# Altium project AMC_FMC_Carrier v2.PrjPcb (part 3 of 9)

## Sheet FMC_HPC1.SchDoc
size A3; DocumentNumber: 19; SheetNumber: 19; SheetTotal: 30
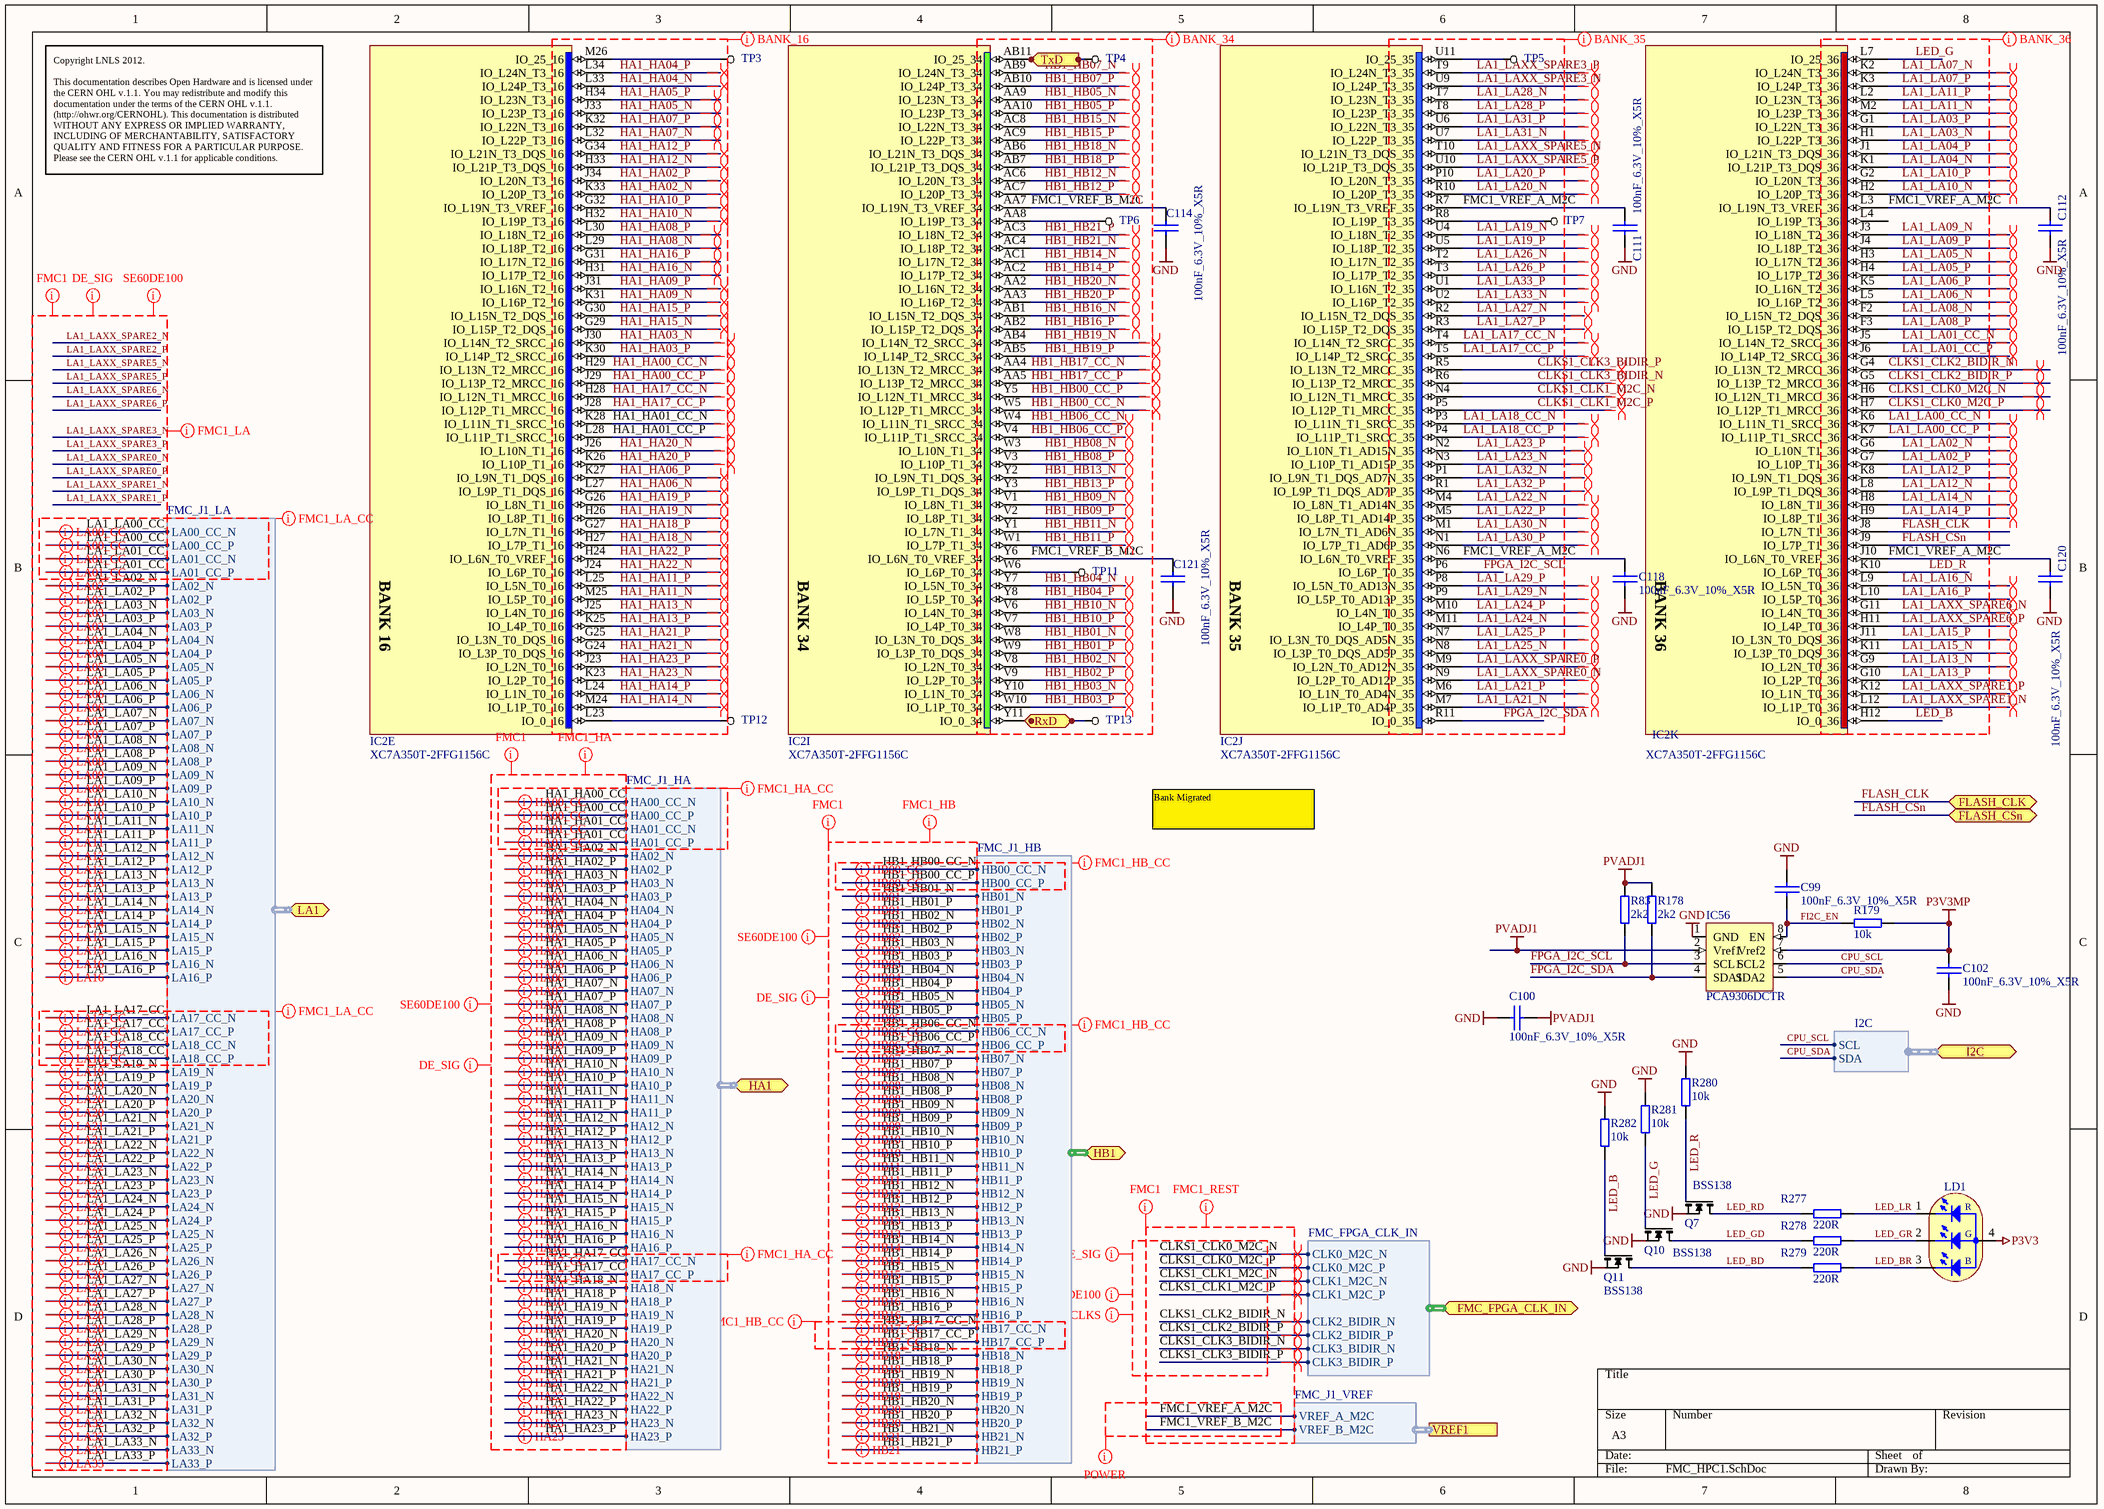
[diagram p5: FMC_HPC1.SchDoc]

### Parts
C99  100nF_6.3V_10%_X5R  [0201C]
C100  100nF_6.3V_10%_X5R  [0201C]
C102  100nF_6.3V_10%_X5R  [0201C]
C111  100nF_6.3V_10%_X5R  [0201C]
C112  100nF_6.3V_10%_X5R  [0201C]
C114  100nF_6.3V_10%_X5R  [0201C]
C118  100nF_6.3V_10%_X5R  [0201C]
C120  100nF_6.3V_10%_X5R  [0201C]
C121  100nF_6.3V_10%_X5R  [0201C]
IC2  XC7A350T-2FFG1156C  [BGA1156C100P34X34_3500X3500X335]  (parts E,I,J,K of 23)
IC56  PCA9306DCTR  [SSOP8]
LD1  Red/Green/Blue  [LED_OPTEK_OVSRRGBCC3_a]  (value not drawn)
Q7  BSS138  [SOT-23]
Q10  BSS138  [SOT-23]
Q11  BSS138  [SOT-23]
R83  2k2  [0402R]
R178  2k2  [0402R]
R179  10k  [0402R]
R277  220R  [0402R]
R278  220R  [0402R]
R279  220R  [0402R]
R280  10k  [0402R]
R281  10k  [0402R]
R282  10k  [0402R]
TP3  TP  [TP_large]  (value not drawn)
TP4  TP  [TP_large]  (value not drawn)
TP5  TP  [TP_large]  (value not drawn)
TP6  TP  [TP_large]  (value not drawn)
TP7  TP  [TP_large]  (value not drawn)
TP11  TP  [TP_large]  (value not drawn)
TP12  TP  [TP_large]  (value not drawn)
TP13  TP  [TP_large]  (value not drawn)

### Ports
FLASH_CLK, FLASH_CSn, FMC_FPGA_CLK_IN (harness FMC_FPGA_CLK_IN), HA1 (harness FMC_J1_HA), HB1 (harness FMC_J1_HB), I2C (harness I2C), LA1 (harness FMC_J1_LA), RxD (out), TxD (in), VREF1 (harness FMC_J1_VREF)

### Harnesses
FMC_J1_LA: LA05_N, LA05_P, LA06_N, LA06_P, LA09_N, LA09_P, LA10_N, LA10_P, LA13_N, LA13_P, LA14_N, LA14_P, LA23_N, LA23_P, LA26_N, LA26_P, LA27_N, LA27_P, LA02_N, LA02_P, LA03_N, LA03_P, LA04_N, LA04_P, LA07_N, LA07_P, LA08_N, LA08_P, LA11_N, LA11_P, LA12_N, LA12_P, LA15_N, LA15_P, LA16_N, LA16_P, LA19_N, LA19_P, LA20_N, LA20_P, LA21_N, LA21_P, LA22_N, LA22_P, LA24_N, LA24_P, LA25_N, LA25_P, LA28_N, LA28_P, LA29_N, LA29_P, LA30_N, LA30_P, LA31_N, LA31_P, LA32_N, LA32_P, LA33_N, LA33_P, LA00_CC_N, LA00_CC_P, LA01_CC_N, LA01_CC_P, LA17_CC_N, LA17_CC_P, LA18_CC_N, LA18_CC_P
FMC_J1_VREF: VREF_A_M2C, VREF_B_M2C
FMC_FPGA_CLK_IN: CLK0_M2C_N, CLK0_M2C_P, CLK1_M2C_N, CLK1_M2C_P, CLK2_BIDIR_N, CLK2_BIDIR_P, CLK3_BIDIR_N, CLK3_BIDIR_P
FMC_J1_HB: HB02_N, HB02_P, HB03_N, HB03_P, HB04_N, HB04_P, HB05_N, HB05_P, HB08_N, HB08_P, HB09_N, HB09_P, HB12_N, HB12_P, HB13_N, HB13_P, HB16_N, HB16_P, HB19_N, HB19_P, HB20_N, HB20_P, HB21_N, HB21_P, HB01_N, HB01_P, HB07_N, HB07_P, HB10_N, HB10_P, HB11_N, HB11_P, HB14_N, HB14_P, HB15_N, HB15_P, HB18_N, HB18_P, HB17_CC_N, HB17_CC_P, HB06_CC_N, HB06_CC_P, HB00_CC_N, HB00_CC_P
FMC_J1_HA: HA04_N, HA04_P, HA05_N, HA05_P, HA08_N, HA08_P, HA09_N, HA09_P, HA12_N, HA12_P, HA13_N, HA13_P, HA15_N, HA15_P, HA16_N, HA16_P, HA19_N, HA19_P, HA20_N, HA20_P, HA02_N, HA02_P, HA03_N, HA03_P, HA06_N, HA06_P, HA07_N, HA07_P, HA10_N, HA10_P, HA11_N, HA11_P, HA14_N, HA14_P, HA18_N, HA18_P, HA21_N, HA21_P, HA22_N, HA22_P, HA23_N, HA23_P, HA17_CC_N, HA17_CC_P, HA00_CC_N, HA00_CC_P, HA01_CC_N, HA01_CC_P
I2C: SCL, SDA

### Nets
GND: C99.2 C100.2 C102.2 C111.2 C112.2 C114.2 C118.2 C120.2 C121.2 IC56.1(GND) Q7.2(S) Q10.2(S) Q11.2(S) R280.1 R281.1 R282.1
P3V3: LD1.4(CC)
P3V3MP: C102.1 IC56.7(Vref2) R179.2
PVADJ1: C100.1 IC56.2(Vref1) R83.2 R178.2
CLKS1_CLK0_M2C_N: IC2.H6(IO_L12N_T1_MRCC_36) ; port FMC_FPGA_CLK_IN.CLK0_M2C_N  [project net FMCC1.CLK0_M2C_N]
CLKS1_CLK0_M2C_P: IC2.H7(IO_L12P_T1_MRCC_36) ; port FMC_FPGA_CLK_IN.CLK0_M2C_P  [project net FMCC1.CLK0_M2C_P]
CLKS1_CLK1_M2C_N: IC2.N4(IO_L12N_T1_MRCC_35) ; port FMC_FPGA_CLK_IN.CLK1_M2C_N  [project net FMCC1.CLK1_M2C_N]
CLKS1_CLK1_M2C_P: IC2.P5(IO_L12P_T1_MRCC_35) ; port FMC_FPGA_CLK_IN.CLK1_M2C_P  [project net FMCC1.CLK1_M2C_P]
CLKS1_CLK2_BIDIR_N: IC2.G4(IO_L13N_T2_MRCC_36) ; port FMC_FPGA_CLK_IN.CLK2_BIDIR_N  [project net FMCC1.CLK2_BIDIR_N]
CLKS1_CLK2_BIDIR_P: IC2.G5(IO_L13P_T2_MRCC_36) ; port FMC_FPGA_CLK_IN.CLK2_BIDIR_P  [project net FMCC1.CLK2_BIDIR_P]
CLKS1_CLK3_BIDIR_N: IC2.R6(IO_L13P_T2_MRCC_35) ; port FMC_FPGA_CLK_IN.CLK3_BIDIR_N  [project net FMCC1.CLK3_BIDIR_N]
CLKS1_CLK3_BIDIR_P: IC2.R5(IO_L13N_T2_MRCC_35) ; port FMC_FPGA_CLK_IN.CLK3_BIDIR_P  [project net FMCC1.CLK3_BIDIR_P]
CPU_SCL: IC56.6(SCL2) ; port I2C.SCL  [project net CPU.SCL]
CPU_SDA: IC56.5(SDA2) ; port I2C.SDA  [project net CPU.SDA]
FI2C_EN: C99.1 IC56.8(EN) R179.1
FLASH_CLK: IC2.J8(IO_L7N_T1_36) ; port FLASH_CLK
FLASH_CSn: IC2.J9(IO_L7P_T1_36) ; port FLASH_CSn
FMC1_VREF_A_M2C: C111.1 C112.1 C118.1 C120.1 IC2.J10(IO_L6N_T0_VREF_36) IC2.L3(IO_L19N_T3_VREF_36) IC2.N6(IO_L6N_T0_VREF_35) IC2.R7(IO_L19N_T3_VREF_35) ; port VREF1.VREF_A_M2C  [project net VREF1.VREF_A_M2C]
FMC1_VREF_B_M2C: C114.1 C121.1 IC2.AA7(IO_L19N_T3_VREF_34) IC2.Y6(IO_L6N_T0_VREF_34) ; port VREF1.VREF_B_M2C  [project net VREF1.VREF_B_M2C]
FPGA_I2C_SCL: IC2.P6(IO_L6P_T0_35) IC56.3(SCL1) R83.1
FPGA_I2C_SDA: IC2.R11(IO_0_35) IC56.4(SDA1) R178.1
HA1_HA00_CC_N: IC2.H29(IO_L13N_T2_MRCC_16) ; port HA1.HA00_CC_N  [project net HA1.HA00_CC_N]
HA1_HA00_CC_P: IC2.J29(IO_L13P_T2_MRCC_16) ; port HA1.HA00_CC_P  [project net HA1.HA00_CC_P]
HA1_HA01_CC_N: IC2.K28(IO_L11N_T1_SRCC_16) ; port HA1.HA01_CC_N  [project net HA1.HA01_CC_N]
HA1_HA01_CC_P: IC2.L28(IO_L11P_T1_SRCC_16) ; port HA1.HA01_CC_P  [project net HA1.HA01_CC_P]
HA1_HA02_N: IC2.K33(IO_L20P_T3_16) ; port HA1.HA02_N  [project net HA1.HA02_N]
HA1_HA02_P: IC2.J34(IO_L20N_T3_16) ; port HA1.HA02_P  [project net HA1.HA02_P]
HA1_HA03_N: IC2.J30(IO_L14N_T2_SRCC_16) ; port HA1.HA03_N  [project net HA1.HA03_N]
HA1_HA03_P: IC2.K30(IO_L14P_T2_SRCC_16) ; port HA1.HA03_P  [project net HA1.HA03_P]
HA1_HA04_N: IC2.L33(IO_L24P_T3_16) ; port HA1.HA04_N  [project net HA1.HA04_N]
HA1_HA04_P: IC2.L34(IO_L24N_T3_16) ; port HA1.HA04_P  [project net HA1.HA04_P]
HA1_HA05_N: IC2.J33(IO_L23P_T3_16) ; port HA1.HA05_N  [project net HA1.HA05_N]
HA1_HA05_P: IC2.H34(IO_L23N_T3_16) ; port HA1.HA05_P  [project net HA1.HA05_P]
HA1_HA06_N: IC2.L27(IO_L9P_T1_DQS_16) ; port HA1.HA06_N  [project net HA1.HA06_N]
HA1_HA06_P: IC2.K27(IO_L9N_T1_DQS_16) ; port HA1.HA06_P  [project net HA1.HA06_P]
HA1_HA07_N: IC2.L32(IO_L22P_T3_16) ; port HA1.HA07_N  [project net HA1.HA07_N]
HA1_HA07_P: IC2.K32(IO_L22N_T3_16) ; port HA1.HA07_P  [project net HA1.HA07_P]
HA1_HA08_N: IC2.L29(IO_L18P_T2_16) ; port HA1.HA08_N  [project net HA1.HA08_N]
HA1_HA08_P: IC2.L30(IO_L18N_T2_16) ; port HA1.HA08_P  [project net HA1.HA08_P]
HA1_HA09_N: IC2.K31(IO_L16P_T2_16) ; port HA1.HA09_N  [project net HA1.HA09_N]
HA1_HA09_P: IC2.J31(IO_L16N_T2_16) ; port HA1.HA09_P  [project net HA1.HA09_P]
HA1_HA10_N: IC2.H32(IO_L19P_T3_16) ; port HA1.HA10_N  [project net HA1.HA10_N]
HA1_HA10_P: IC2.G32(IO_L19N_T3_VREF_16) ; port HA1.HA10_P  [project net HA1.HA10_P]
HA1_HA11_N: IC2.M25(IO_L5P_T0_16) ; port HA1.HA11_N  [project net HA1.HA11_N]
HA1_HA11_P: IC2.L25(IO_L5N_T0_16) ; port HA1.HA11_P  [project net HA1.HA11_P]
HA1_HA12_N: IC2.H33(IO_L21P_T3_DQS_16) ; port HA1.HA12_N  [project net HA1.HA12_N]
HA1_HA12_P: IC2.G34(IO_L21N_T3_DQS_16) ; port HA1.HA12_P  [project net HA1.HA12_P]
HA1_HA13_N: IC2.J25(IO_L4N_T0_16) ; port HA1.HA13_N  [project net HA1.HA13_N]
HA1_HA13_P: IC2.K25(IO_L4P_T0_16) ; port HA1.HA13_P  [project net HA1.HA13_P]
HA1_HA14_N: IC2.M24(IO_L1P_T0_16) ; port HA1.HA14_N  [project net HA1.HA14_N]
HA1_HA14_P: IC2.L24(IO_L1N_T0_16) ; port HA1.HA14_P  [project net HA1.HA14_P]
HA1_HA15_N: IC2.G29(IO_L15P_T2_DQS_16) ; port HA1.HA15_N  [project net HA1.HA15_N]
HA1_HA15_P: IC2.G30(IO_L15N_T2_DQS_16) ; port HA1.HA15_P  [project net HA1.HA15_P]
HA1_HA16_N: IC2.H31(IO_L17P_T2_16) ; port HA1.HA16_N  [project net HA1.HA16_N]
HA1_HA16_P: IC2.G31(IO_L17N_T2_16) ; port HA1.HA16_P  [project net HA1.HA16_P]
HA1_HA17_CC_N: IC2.H28(IO_L12N_T1_MRCC_16) ; port HA1.HA17_CC_N  [project net HA1.HA17_CC_N]
HA1_HA17_CC_P: IC2.J28(IO_L12P_T1_MRCC_16) ; port HA1.HA17_CC_P  [project net HA1.HA17_CC_P]
HA1_HA18_N: IC2.H27(IO_L7P_T1_16) ; port HA1.HA18_N  [project net HA1.HA18_N]
HA1_HA18_P: IC2.G27(IO_L7N_T1_16) ; port HA1.HA18_P  [project net HA1.HA18_P]
HA1_HA19_N: IC2.H26(IO_L8P_T1_16) ; port HA1.HA19_N  [project net HA1.HA19_N]
HA1_HA19_P: IC2.G26(IO_L8N_T1_16) ; port HA1.HA19_P  [project net HA1.HA19_P]
HA1_HA20_N: IC2.J26(IO_L10N_T1_16) ; port HA1.HA20_N  [project net HA1.HA20_N]
HA1_HA20_P: IC2.K26(IO_L10P_T1_16) ; port HA1.HA20_P  [project net HA1.HA20_P]
HA1_HA21_N: IC2.G24(IO_L3P_T0_DQS_16) ; port HA1.HA21_N  [project net HA1.HA21_N]
HA1_HA21_P: IC2.G25(IO_L3N_T0_DQS_16) ; port HA1.HA21_P  [project net HA1.HA21_P]
HA1_HA22_N: IC2.J24(IO_L6P_T0_16) ; port HA1.HA22_N  [project net HA1.HA22_N]
HA1_HA22_P: IC2.H24(IO_L6N_T0_VREF_16) ; port HA1.HA22_P  [project net HA1.HA22_P]
HA1_HA23_N: IC2.K23(IO_L2P_T0_16) ; port HA1.HA23_N  [project net HA1.HA23_N]
HA1_HA23_P: IC2.J23(IO_L2N_T0_16) ; port HA1.HA23_P  [project net HA1.HA23_P]
HB1_HB00_CC_N: IC2.W5(IO_L12P_T1_MRCC_34) ; port HB1.HB00_CC_N  [project net HB1.HB00_CC_N]
HB1_HB00_CC_P: IC2.Y5(IO_L12N_T1_MRCC_34) ; port HB1.HB00_CC_P  [project net HB1.HB00_CC_P]
HB1_HB01_N: IC2.W8(IO_L3N_T0_DQS_34) ; port HB1.HB01_N  [project net HB1.HB01_N]
HB1_HB01_P: IC2.W9(IO_L3P_T0_DQS_34) ; port HB1.HB01_P  [project net HB1.HB01_P]
HB1_HB02_N: IC2.V8(IO_L2N_T0_34) ; port HB1.HB02_N  [project net HB1.HB02_N]
HB1_HB02_P: IC2.V9(IO_L2P_T0_34) ; port HB1.HB02_P  [project net HB1.HB02_P]
HB1_HB03_N: IC2.Y10(IO_L1N_T0_34) ; port HB1.HB03_N  [project net HB1.HB03_N]
HB1_HB03_P: IC2.W10(IO_L1P_T0_34) ; port HB1.HB03_P  [project net HB1.HB03_P]
HB1_HB04_N: IC2.Y7(IO_L5N_T0_34) ; port HB1.HB04_N  [project net HB1.HB04_N]
HB1_HB04_P: IC2.Y8(IO_L5P_T0_34) ; port HB1.HB04_P  [project net HB1.HB04_P]
HB1_HB05_N: IC2.AA9(IO_L23N_T3_34) ; port HB1.HB05_N  [project net HB1.HB05_N]
HB1_HB05_P: IC2.AA10(IO_L23P_T3_34) ; port HB1.HB05_P  [project net HB1.HB05_P]
HB1_HB06_CC_N: IC2.W4(IO_L11N_T1_SRCC_34) ; port HB1.HB06_CC_N  [project net HB1.HB06_CC_N]
HB1_HB06_CC_P: IC2.V4(IO_L11P_T1_SRCC_34) ; port HB1.HB06_CC_P  [project net HB1.HB06_CC_P]
HB1_HB07_N: IC2.AB9(IO_L24N_T3_34) ; port HB1.HB07_N  [project net HB1.HB07_N]
HB1_HB07_P: IC2.AB10(IO_L24P_T3_34) ; port HB1.HB07_P  [project net HB1.HB07_P]
HB1_HB08_N: IC2.W3(IO_L10N_T1_34) ; port HB1.HB08_N  [project net HB1.HB08_N]
HB1_HB08_P: IC2.V3(IO_L10P_T1_34) ; port HB1.HB08_P  [project net HB1.HB08_P]
HB1_HB09_N: IC2.V1(IO_L8N_T1_34) ; port HB1.HB09_N  [project net HB1.HB09_N]
HB1_HB09_P: IC2.V2(IO_L8P_T1_34) ; port HB1.HB09_P  [project net HB1.HB09_P]
HB1_HB10_N: IC2.V6(IO_L4N_T0_34) ; port HB1.HB10_N  [project net HB1.HB10_N]
HB1_HB10_P: IC2.V7(IO_L4P_T0_34) ; port HB1.HB10_P  [project net HB1.HB10_P]
HB1_HB11_N: IC2.Y1(IO_L7N_T1_34) ; port HB1.HB11_N  [project net HB1.HB11_N]
HB1_HB11_P: IC2.W1(IO_L7P_T1_34) ; port HB1.HB11_P  [project net HB1.HB11_P]
HB1_HB12_N: IC2.AC6(IO_L20N_T3_34) ; port HB1.HB12_N  [project net HB1.HB12_N]
HB1_HB12_P: IC2.AC7(IO_L20P_T3_34) ; port HB1.HB12_P  [project net HB1.HB12_P]
HB1_HB13_N: IC2.Y2(IO_L9N_T1_DQS_34) ; port HB1.HB13_N  [project net HB1.HB13_N]
HB1_HB13_P: IC2.Y3(IO_L9P_T1_DQS_34) ; port HB1.HB13_P  [project net HB1.HB13_P]
HB1_HB14_N: IC2.AC1(IO_L17N_T2_34) ; port HB1.HB14_N  [project net HB1.HB14_N]
HB1_HB14_P: IC2.AC2(IO_L17P_T2_34) ; port HB1.HB14_P  [project net HB1.HB14_P]
HB1_HB15_N: IC2.AC8(IO_L22N_T3_34) ; port HB1.HB15_N  [project net HB1.HB15_N]
HB1_HB15_P: IC2.AC9(IO_L22P_T3_34) ; port HB1.HB15_P  [project net HB1.HB15_P]
HB1_HB16_N: IC2.AB1(IO_L15N_T2_DQS_34) ; port HB1.HB16_N  [project net HB1.HB16_N]
HB1_HB16_P: IC2.AB2(IO_L15P_T2_DQS_34) ; port HB1.HB16_P  [project net HB1.HB16_P]
HB1_HB17_CC_N: IC2.AA4(IO_L13N_T2_MRCC_34) ; port HB1.HB17_CC_N  [project net HB1.HB17_CC_N]
HB1_HB17_CC_P: IC2.AA5(IO_L13P_T2_MRCC_34) ; port HB1.HB17_CC_P  [project net HB1.HB17_CC_P]
HB1_HB18_N: IC2.AB6(IO_L21N_T3_DQS_34) ; port HB1.HB18_N  [project net HB1.HB18_N]
HB1_HB18_P: IC2.AB7(IO_L21P_T3_DQS_34) ; port HB1.HB18_P  [project net HB1.HB18_P]
HB1_HB19_N: IC2.AB4(IO_L14N_T2_SRCC_34) ; port HB1.HB19_N  [project net HB1.HB19_N]
HB1_HB19_P: IC2.AB5(IO_L14P_T2_SRCC_34) ; port HB1.HB19_P  [project net HB1.HB19_P]
HB1_HB20_N: IC2.AA2(IO_L16N_T2_34) ; port HB1.HB20_N  [project net HB1.HB20_N]
HB1_HB20_P: IC2.AA3(IO_L16P_T2_34) ; port HB1.HB20_P  [project net HB1.HB20_P]
HB1_HB21_N: IC2.AC4(IO_L18P_T2_34) ; port HB1.HB21_N  [project net HB1.HB21_N]
HB1_HB21_P: IC2.AC3(IO_L18N_T2_34) ; port HB1.HB21_P  [project net HB1.HB21_P]
LA1_LA00_CC_N: IC2.K6(IO_L11N_T1_SRCC_36) ; port LA1.LA00_CC_N  [project net LA1.LA00_CC_N]
LA1_LA00_CC_P: IC2.K7(IO_L11P_T1_SRCC_36) ; port LA1.LA00_CC_P  [project net LA1.LA00_CC_P]
LA1_LA01_CC_N: IC2.J5(IO_L14N_T2_SRCC_36) ; port LA1.LA01_CC_N  [project net LA1.LA01_CC_N]
LA1_LA01_CC_P: IC2.J6(IO_L14P_T2_SRCC_36) ; port LA1.LA01_CC_P  [project net LA1.LA01_CC_P]
LA1_LA02_N: IC2.G6(IO_L10N_T1_36) ; port LA1.LA02_N  [project net LA1.LA02_N]
LA1_LA02_P: IC2.G7(IO_L10P_T1_36) ; port LA1.LA02_P  [project net LA1.LA02_P]
LA1_LA03_N: IC2.H1(IO_L22P_T3_36) ; port LA1.LA03_N  [project net LA1.LA03_N]
LA1_LA03_P: IC2.G1(IO_L22N_T3_36) ; port LA1.LA03_P  [project net LA1.LA03_P]
LA1_LA04_N: IC2.K1(IO_L21P_T3_DQS_36) ; port LA1.LA04_N  [project net LA1.LA04_N]
LA1_LA04_P: IC2.J1(IO_L21N_T3_DQS_36) ; port LA1.LA04_P  [project net LA1.LA04_P]
LA1_LA05_N: IC2.H3(IO_L17N_T2_36) ; port LA1.LA05_N  [project net LA1.LA05_N]
LA1_LA05_P: IC2.H4(IO_L17P_T2_36) ; port LA1.LA05_P  [project net LA1.LA05_P]
LA1_LA06_N: IC2.L5(IO_L16P_T2_36) ; port LA1.LA06_N  [project net LA1.LA06_N]
LA1_LA06_P: IC2.K5(IO_L16N_T2_36) ; port LA1.LA06_P  [project net LA1.LA06_P]
LA1_LA07_N: IC2.K2(IO_L24N_T3_36) ; port LA1.LA07_N  [project net LA1.LA07_N]
LA1_LA07_P: IC2.K3(IO_L24P_T3_36) ; port LA1.LA07_P  [project net LA1.LA07_P]
LA1_LA08_N: IC2.F2(IO_L15N_T2_DQS_36) ; port LA1.LA08_N  [project net LA1.LA08_N]
LA1_LA08_P: IC2.F3(IO_L15P_T2_DQS_36) ; port LA1.LA08_P  [project net LA1.LA08_P]
LA1_LA09_N: IC2.J3(IO_L18N_T2_36) ; port LA1.LA09_N  [project net LA1.LA09_N]
LA1_LA09_P: IC2.J4(IO_L18P_T2_36) ; port LA1.LA09_P  [project net LA1.LA09_P]
LA1_LA10_N: IC2.H2(IO_L20P_T3_36) ; port LA1.LA10_N  [project net LA1.LA10_N]
LA1_LA10_P: IC2.G2(IO_L20N_T3_36) ; port LA1.LA10_P  [project net LA1.LA10_P]
LA1_LA11_N: IC2.M2(IO_L23P_T3_36) ; port LA1.LA11_N  [project net LA1.LA11_N]
LA1_LA11_P: IC2.L2(IO_L23N_T3_36) ; port LA1.LA11_P  [project net LA1.LA11_P]
LA1_LA12_N: IC2.L8(IO_L9P_T1_DQS_36) ; port LA1.LA12_N  [project net LA1.LA12_N]
LA1_LA12_P: IC2.K8(IO_L9N_T1_DQS_36) ; port LA1.LA12_P  [project net LA1.LA12_P]
LA1_LA13_N: IC2.G9(IO_L2N_T0_36) ; port LA1.LA13_N  [project net LA1.LA13_N]
LA1_LA13_P: IC2.G10(IO_L2P_T0_36) ; port LA1.LA13_P  [project net LA1.LA13_P]
LA1_LA14_N: IC2.H8(IO_L8N_T1_36) ; port LA1.LA14_N  [project net LA1.LA14_N]
LA1_LA14_P: IC2.H9(IO_L8P_T1_36) ; port LA1.LA14_P  [project net LA1.LA14_P]
LA1_LA15_N: IC2.K11(IO_L3P_T0_DQS_36) ; port LA1.LA15_N  [project net LA1.LA15_N]
LA1_LA15_P: IC2.J11(IO_L3N_T0_DQS_36) ; port LA1.LA15_P  [project net LA1.LA15_P]
LA1_LA16_N: IC2.L9(IO_L5N_T0_36) ; port LA1.LA16_N  [project net LA1.LA16_N]
LA1_LA16_P: IC2.L10(IO_L5P_T0_36) ; port LA1.LA16_P  [project net LA1.LA16_P]
LA1_LA17_CC_N: IC2.T4(IO_L14N_T2_SRCC_35) ; port LA1.LA17_CC_N  [project net LA1.LA17_CC_N]
LA1_LA17_CC_P: IC2.T5(IO_L14P_T2_SRCC_35) ; port LA1.LA17_CC_P  [project net LA1.LA17_CC_P]
LA1_LA18_CC_N: IC2.P3(IO_L11N_T1_SRCC_35) ; port LA1.LA18_CC_N  [project net LA1.LA18_CC_N]
LA1_LA18_CC_P: IC2.P4(IO_L11P_T1_SRCC_35) ; port LA1.LA18_CC_P  [project net LA1.LA18_CC_P]
LA1_LA19_N: IC2.U4(IO_L18N_T2_35) ; port LA1.LA19_N  [project net LA1.LA19_N]
LA1_LA19_P: IC2.U5(IO_L18P_T2_35) ; port LA1.LA19_P  [project net LA1.LA19_P]
LA1_LA20_N: IC2.R10(IO_L20P_T3_35) ; port LA1.LA20_N  [project net LA1.LA20_N]
LA1_LA20_P: IC2.P10(IO_L20N_T3_35) ; port LA1.LA20_P  [project net LA1.LA20_P]
LA1_LA21_N: IC2.M7(IO_L1P_T0_AD4P_35) ; port LA1.LA21_N  [project net LA1.LA21_N]
LA1_LA21_P: IC2.M6(IO_L1N_T0_AD4N_35) ; port LA1.LA21_P  [project net LA1.LA21_P]
LA1_LA22_N: IC2.M4(IO_L8N_T1_AD14N_35) ; port LA1.LA22_N  [project net LA1.LA22_N]
LA1_LA22_P: IC2.M5(IO_L8P_T1_AD14P_35) ; port LA1.LA22_P  [project net LA1.LA22_P]
LA1_LA23_N: IC2.N3(IO_L10P_T1_AD15P_35) ; port LA1.LA23_N  [project net LA1.LA23_N]
LA1_LA23_P: IC2.N2(IO_L10N_T1_AD15N_35) ; port LA1.LA23_P  [project net LA1.LA23_P]
LA1_LA24_N: IC2.M11(IO_L4P_T0_35) ; port LA1.LA24_N  [project net LA1.LA24_N]
LA1_LA24_P: IC2.M10(IO_L4N_T0_35) ; port LA1.LA24_P  [project net LA1.LA24_P]
LA1_LA25_N: IC2.N8(IO_L3P_T0_DQS_AD5P_35) ; port LA1.LA25_N  [project net LA1.LA25_N]
LA1_LA25_P: IC2.N7(IO_L3N_T0_DQS_AD5N_35) ; port LA1.LA25_P  [project net LA1.LA25_P]
LA1_LA26_N: IC2.T2(IO_L17N_T2_35) ; port LA1.LA26_N  [project net LA1.LA26_N]
LA1_LA26_P: IC2.T3(IO_L17P_T2_35) ; port LA1.LA26_P  [project net LA1.LA26_P]
LA1_LA27_N: IC2.R2(IO_L15N_T2_DQS_35) ; port LA1.LA27_N  [project net LA1.LA27_N]
LA1_LA27_P: IC2.R3(IO_L15P_T2_DQS_35) ; port LA1.LA27_P  [project net LA1.LA27_P]
LA1_LA28_N: IC2.T7(IO_L23N_T3_35) ; port LA1.LA28_N  [project net LA1.LA28_N]
LA1_LA28_P: IC2.T8(IO_L23P_T3_35) ; port LA1.LA28_P  [project net LA1.LA28_P]
LA1_LA29_N: IC2.P9(IO_L5P_T0_AD13P_35) ; port LA1.LA29_N  [project net LA1.LA29_N]
LA1_LA29_P: IC2.P8(IO_L5N_T0_AD13N_35) ; port LA1.LA29_P  [project net LA1.LA29_P]
LA1_LA30_N: IC2.M1(IO_L7N_T1_AD6N_35) ; port LA1.LA30_N  [project net LA1.LA30_N]
LA1_LA30_P: IC2.N1(IO_L7P_T1_AD6P_35) ; port LA1.LA30_P  [project net LA1.LA30_P]
LA1_LA31_N: IC2.U7(IO_L22P_T3_35) ; port LA1.LA31_N  [project net LA1.LA31_N]
LA1_LA31_P: IC2.U6(IO_L22N_T3_35) ; port LA1.LA31_P  [project net LA1.LA31_P]
LA1_LA32_N: IC2.P1(IO_L9N_T1_DQS_AD7N_35) ; port LA1.LA32_N  [project net LA1.LA32_N]
LA1_LA32_P: IC2.R1(IO_L9P_T1_DQS_AD7P_35) ; port LA1.LA32_P  [project net LA1.LA32_P]
LA1_LA33_N: IC2.U2(IO_L16P_T2_35) ; port LA1.LA33_N  [project net LA1.LA33_N]
LA1_LA33_P: IC2.U1(IO_L16N_T2_35) ; port LA1.LA33_P  [project net LA1.LA33_P]
LA1_LAXX_SPARE0_N: IC2.N9(IO_L2P_T0_AD12P_35)
LA1_LAXX_SPARE0_P: IC2.M9(IO_L2N_T0_AD12N_35)
LA1_LAXX_SPARE1_N: IC2.L12(IO_L1P_T0_36)
LA1_LAXX_SPARE1_P: IC2.K12(IO_L1N_T0_36)
LA1_LAXX_SPARE3_N: IC2.U9(IO_L24P_T3_35)
LA1_LAXX_SPARE3_P: IC2.T9(IO_L24N_T3_35)
LA1_LAXX_SPARE5_N: IC2.T10(IO_L21N_T3_DQS_35)
LA1_LAXX_SPARE5_P: IC2.U10(IO_L21P_T3_DQS_35)
LA1_LAXX_SPARE6_N: IC2.G11(IO_L4N_T0_36)
LA1_LAXX_SPARE6_P: IC2.H11(IO_L4P_T0_36)
LED_B: IC2.H12(IO_0_36) Q11.1(G) R282.2
LED_BD: Q11.3(D) R279.1
LED_BR: LD1.3(AB) R279.2
LED_G: IC2.L7(IO_25_36) Q10.1(G) R281.2
LED_GD: Q10.3(D) R278.1
LED_GR: LD1.2(AG) R278.2
LED_LR: LD1.1(AR) R277.2
LED_R: IC2.K10(IO_L6P_T0_36) Q7.1(G) R280.2
LED_RD: Q7.3(D) R277.1
RxD_USB: IC2.Y11(IO_0_34) TP13.1 ; port RxD
TxD_USB: IC2.AB11(IO_25_34) TP4.1 ; port TxD
NetIC2_AA8: IC2.AA8(IO_L19P_T3_34) TP6.1
NetIC2_L23: IC2.L23(IO_0_16) TP12.1
NetIC2_M26: IC2.M26(IO_25_16) TP3.1
NetIC2_R8: IC2.R8(IO_L19P_T3_35) TP7.1
NetIC2_U11: IC2.U11(IO_25_35) TP5.1
NetIC2_W6: IC2.W6(IO_L6P_T0_34) TP11.1

Not connected (* = marked no-connect by the designer): IC2 L4(IO_L19P_T3_36)

### Layout directives
differential pair: FMCC1.CLK0_M2C_N, FMCC1.CLK0_M2C_P, FMCC1.CLK1_M2C_N, FMCC1.CLK1_M2C_P, FMCC1.CLK2_BIDIR_N, FMCC1.CLK2_BIDIR_P, FMCC1.CLK3_BIDIR_N, FMCC1.CLK3_BIDIR_P, HA1.HA00_CC_N, HA1.HA00_CC_P, HA1.HA01_CC_N, HA1.HA01_CC_P, HA1.HA02_N, HA1.HA02_P, HA1.HA03_N, HA1.HA03_P, HA1.HA04_N, HA1.HA04_P, HA1.HA05_N, HA1.HA05_P, HA1.HA06_N, HA1.HA06_P, HA1.HA07_N, HA1.HA07_P, HA1.HA08_N, HA1.HA08_P, HA1.HA09_N, HA1.HA09_P, HA1.HA10_N, HA1.HA10_P, HA1.HA11_N, HA1.HA11_P, HA1.HA12_N, HA1.HA12_P, HA1.HA13_N, HA1.HA13_P, HA1.HA14_N, HA1.HA14_P, HA1.HA15_N, HA1.HA15_P, HA1.HA16_N, HA1.HA16_P, HA1.HA17_CC_N, HA1.HA17_CC_P, HA1.HA18_N, HA1.HA18_P, HA1.HA19_N, HA1.HA19_P, HA1.HA20_N, HA1.HA20_P, HA1.HA21_N, HA1.HA21_P, HA1.HA22_N, HA1.HA22_P, HA1.HA23_N, HA1.HA23_P, HB1.HB00_CC_N, HB1.HB00_CC_P, HB1.HB01_N, HB1.HB01_P, HB1.HB02_N, HB1.HB02_P, HB1.HB03_N, HB1.HB03_P, HB1.HB04_N, HB1.HB04_P, HB1.HB05_N, HB1.HB05_P, HB1.HB06_CC_N, HB1.HB06_CC_P, HB1.HB07_N, HB1.HB07_P, HB1.HB08_N, HB1.HB08_P, HB1.HB09_N, HB1.HB09_P, HB1.HB10_N, HB1.HB10_P, HB1.HB11_N, HB1.HB11_P, HB1.HB12_N, HB1.HB12_P, HB1.HB13_N, HB1.HB13_P, HB1.HB14_N, HB1.HB14_P, HB1.HB15_N, HB1.HB15_P, HB1.HB16_N, HB1.HB16_P, HB1.HB17_CC_N, HB1.HB17_CC_P, HB1.HB18_N, HB1.HB18_P, HB1.HB19_N, HB1.HB19_P, HB1.HB20_N, HB1.HB20_P, HB1.HB21_N, HB1.HB21_P, LA1.LA00_CC_N, LA1.LA00_CC_P, LA1.LA01_CC_N, LA1.LA01_CC_P, LA1.LA02_N, LA1.LA02_P, LA1.LA03_N, LA1.LA03_P, LA1.LA04_N, LA1.LA04_P, LA1.LA05_N, LA1.LA05_P, LA1.LA06_N, LA1.LA06_P, LA1.LA07_N, LA1.LA07_P, LA1.LA08_N, LA1.LA08_P, LA1.LA09_N, LA1.LA09_P, LA1.LA10_N, LA1.LA10_P, LA1.LA11_N, LA1.LA11_P, LA1.LA12_N, LA1.LA12_P, LA1.LA13_N, LA1.LA13_P, LA1.LA14_N, LA1.LA14_P, LA1.LA15_N, LA1.LA15_P, LA1.LA16_N, LA1.LA16_P, LA1.LA17_CC_N, LA1.LA17_CC_P, LA1.LA18_CC_N, LA1.LA18_CC_P, LA1.LA19_N, LA1.LA19_P, LA1.LA20_N, LA1.LA20_P, LA1.LA21_N, LA1.LA21_P, LA1.LA22_N, LA1.LA22_P, LA1.LA23_N, LA1.LA23_P, LA1.LA24_N, LA1.LA24_P, LA1.LA25_N, LA1.LA25_P, LA1.LA26_N, LA1.LA26_P, LA1.LA27_N, LA1.LA27_P, LA1.LA28_N, LA1.LA28_P, LA1.LA29_N, LA1.LA29_P, LA1.LA30_N, LA1.LA30_P, LA1.LA31_N, LA1.LA31_P, LA1.LA32_N, LA1.LA32_P, LA1.LA33_N, LA1.LA33_P, LA1_LAXX_SPARE0_N, LA1_LAXX_SPARE0_P, LA1_LAXX_SPARE1_N, LA1_LAXX_SPARE1_P, LA1_LAXX_SPARE3_N, LA1_LAXX_SPARE3_P, LA1_LAXX_SPARE5_N, LA1_LAXX_SPARE5_P, LA1_LAXX_SPARE6_N, LA1_LAXX_SPARE6_P
net class FMC1: CLKS1_CLK0_M2C_N, CLKS1_CLK0_M2C_P, CLKS1_CLK1_M2C_N, CLKS1_CLK1_M2C_P, CLKS1_CLK2_BIDIR_N, CLKS1_CLK2_BIDIR_P, CLKS1_CLK3_BIDIR_N, CLKS1_CLK3_BIDIR_P, FMC1_VREF_A_M2C, FMC1_VREF_B_M2C, HA1_HA00_CC_N, HA1_HA00_CC_P, HA1_HA01_CC_N, HA1_HA01_CC_P, HA1_HA02_N, HA1_HA02_P, HA1_HA03_N, HA1_HA03_P, HA1_HA04_N, HA1_HA04_P, HA1_HA05_N, HA1_HA05_P, HA1_HA06_N, HA1_HA06_P, HA1_HA07_N, HA1_HA07_P, HA1_HA08_N, HA1_HA08_P, HA1_HA09_N, HA1_HA09_P, HA1_HA10_N, HA1_HA10_P, HA1_HA11_N, HA1_HA11_P, HA1_HA12_N, HA1_HA12_P, HA1_HA13_N, HA1_HA13_P, HA1_HA14_N, HA1_HA14_P, HA1_HA15_N, HA1_HA15_P, HA1_HA16_N, HA1_HA16_P, HA1_HA17_CC_N, HA1_HA17_CC_P, HA1_HA18_N, HA1_HA18_P, HA1_HA19_N, HA1_HA19_P, HA1_HA20_N, HA1_HA20_P, HA1_HA21_N, HA1_HA21_P, HA1_HA22_N, HA1_HA22_P, HA1_HA23_N, HA1_HA23_P, HB1_HB00_CC_N, HB1_HB00_CC_P, HB1_HB01_N, HB1_HB01_P, HB1_HB02_N, HB1_HB02_P, HB1_HB03_N, HB1_HB03_P, HB1_HB04_N, HB1_HB04_P, HB1_HB05_N, HB1_HB05_P, HB1_HB06_CC_N, HB1_HB06_CC_P, HB1_HB07_N, HB1_HB07_P, HB1_HB08_N, HB1_HB08_P, HB1_HB09_N, HB1_HB09_P, HB1_HB10_N, HB1_HB10_P, HB1_HB11_N, HB1_HB11_P, HB1_HB12_N, HB1_HB12_P, HB1_HB13_N, HB1_HB13_P, HB1_HB14_N, HB1_HB14_P, HB1_HB15_N, HB1_HB15_P, HB1_HB16_N, HB1_HB16_P, HB1_HB17_CC_N, HB1_HB17_CC_P, HB1_HB18_N, HB1_HB18_P, HB1_HB19_N, HB1_HB19_P, HB1_HB20_N, HB1_HB20_P, HB1_HB21_N, HB1_HB21_P, LA1_LA00_CC_N, LA1_LA00_CC_P, LA1_LA01_CC_N, LA1_LA01_CC_P, LA1_LA02_N, LA1_LA02_P, LA1_LA03_N, LA1_LA03_P, LA1_LA04_N, LA1_LA04_P, LA1_LA05_N, LA1_LA05_P, LA1_LA06_N, LA1_LA06_P, LA1_LA07_N, LA1_LA07_P, LA1_LA08_N, LA1_LA08_P, LA1_LA09_N, LA1_LA09_P, LA1_LA10_N, LA1_LA10_P, LA1_LA11_N, LA1_LA11_P, LA1_LA12_N, LA1_LA12_P, LA1_LA13_N, LA1_LA13_P, LA1_LA14_N, LA1_LA14_P, LA1_LA15_N, LA1_LA15_P, LA1_LA16_N, LA1_LA16_P, LA1_LA17_CC_N, LA1_LA17_CC_P, LA1_LA18_CC_N, LA1_LA18_CC_P, LA1_LA19_N, LA1_LA19_P, LA1_LA20_N, LA1_LA20_P, LA1_LA21_N, LA1_LA21_P, LA1_LA22_N, LA1_LA22_P, LA1_LA23_N, LA1_LA23_P, LA1_LA24_N, LA1_LA24_P, LA1_LA25_N, LA1_LA25_P, LA1_LA26_N, LA1_LA26_P, LA1_LA27_N, LA1_LA27_P, LA1_LA28_N, LA1_LA28_P, LA1_LA29_N, LA1_LA29_P, LA1_LA30_N, LA1_LA30_P, LA1_LA31_N, LA1_LA31_P, LA1_LA32_N, LA1_LA32_P, LA1_LA33_N, LA1_LA33_P, LA1_LAXX_SPARE0_N, LA1_LAXX_SPARE0_P, LA1_LAXX_SPARE1_N, LA1_LAXX_SPARE1_P, LA1_LAXX_SPARE2_N, LA1_LAXX_SPARE2_P, LA1_LAXX_SPARE3_N, LA1_LAXX_SPARE3_P, LA1_LAXX_SPARE5_N, LA1_LAXX_SPARE5_P, LA1_LAXX_SPARE6_N, LA1_LAXX_SPARE6_P
net class POWER: FMC1_VREF_A_M2C, FMC1_VREF_B_M2C
net class SE60DE100: CLKS1_CLK0_M2C_N, CLKS1_CLK0_M2C_P, CLKS1_CLK1_M2C_N, CLKS1_CLK1_M2C_P, CLKS1_CLK2_BIDIR_N, CLKS1_CLK2_BIDIR_P, CLKS1_CLK3_BIDIR_N, CLKS1_CLK3_BIDIR_P, HA1_HA00_CC_N, HA1_HA00_CC_P, HA1_HA01_CC_N, HA1_HA01_CC_P, HA1_HA02_N, HA1_HA02_P, HA1_HA03_N, HA1_HA03_P, HA1_HA04_N, HA1_HA04_P, HA1_HA05_N, HA1_HA05_P, HA1_HA06_N, HA1_HA06_P, HA1_HA07_N, HA1_HA07_P, HA1_HA08_N, HA1_HA08_P, HA1_HA09_N, HA1_HA09_P, HA1_HA10_N, HA1_HA10_P, HA1_HA11_N, HA1_HA11_P, HA1_HA12_N, HA1_HA12_P, HA1_HA13_N, HA1_HA13_P, HA1_HA14_N, HA1_HA14_P, HA1_HA15_N, HA1_HA15_P, HA1_HA16_N, HA1_HA16_P, HA1_HA17_CC_N, HA1_HA17_CC_P, HA1_HA18_N, HA1_HA18_P, HA1_HA19_N, HA1_HA19_P, HA1_HA20_N, HA1_HA20_P, HA1_HA21_N, HA1_HA21_P, HA1_HA22_N, HA1_HA22_P, HA1_HA23_N, HA1_HA23_P, HB1_HB00_CC_N, HB1_HB00_CC_P, HB1_HB01_N, HB1_HB01_P, HB1_HB02_N, HB1_HB02_P, HB1_HB03_N, HB1_HB03_P, HB1_HB04_N, HB1_HB04_P, HB1_HB05_N, HB1_HB05_P, HB1_HB06_CC_N, HB1_HB06_CC_P, HB1_HB07_N, HB1_HB07_P, HB1_HB08_N, HB1_HB08_P, HB1_HB09_N, HB1_HB09_P, HB1_HB10_N, HB1_HB10_P, HB1_HB11_N, HB1_HB11_P, HB1_HB12_N, HB1_HB12_P, HB1_HB13_N, HB1_HB13_P, HB1_HB14_N, HB1_HB14_P, HB1_HB15_N, HB1_HB15_P, HB1_HB16_N, HB1_HB16_P, HB1_HB17_CC_N, HB1_HB17_CC_P, HB1_HB18_N, HB1_HB18_P, HB1_HB19_N, HB1_HB19_P, HB1_HB20_N, HB1_HB20_P, HB1_HB21_N, HB1_HB21_P, LA1_LA00_CC_N, LA1_LA00_CC_P, LA1_LA01_CC_N, LA1_LA01_CC_P, LA1_LA02_N, LA1_LA02_P, LA1_LA03_N, LA1_LA03_P, LA1_LA04_N, LA1_LA04_P, LA1_LA05_N, LA1_LA05_P, LA1_LA06_N, LA1_LA06_P, LA1_LA07_N, LA1_LA07_P, LA1_LA08_N, LA1_LA08_P, LA1_LA09_N, LA1_LA09_P, LA1_LA10_N, LA1_LA10_P, LA1_LA11_N, LA1_LA11_P, LA1_LA12_N, LA1_LA12_P, LA1_LA13_N, LA1_LA13_P, LA1_LA14_N, LA1_LA14_P, LA1_LA15_N, LA1_LA15_P, LA1_LA16_N, LA1_LA16_P, LA1_LA17_CC_N, LA1_LA17_CC_P, LA1_LA18_CC_N, LA1_LA18_CC_P, LA1_LA19_N, LA1_LA19_P, LA1_LA20_N, LA1_LA20_P, LA1_LA21_N, LA1_LA21_P, LA1_LA22_N, LA1_LA22_P, LA1_LA23_N, LA1_LA23_P, LA1_LA24_N, LA1_LA24_P, LA1_LA25_N, LA1_LA25_P, LA1_LA26_N, LA1_LA26_P, LA1_LA27_N, LA1_LA27_P, LA1_LA28_N, LA1_LA28_P, LA1_LA29_N, LA1_LA29_P, LA1_LA30_N, LA1_LA30_P, LA1_LA31_N, LA1_LA31_P, LA1_LA32_N, LA1_LA32_P, LA1_LA33_N, LA1_LA33_P, LA1_LAXX_SPARE0_N, LA1_LAXX_SPARE0_P, LA1_LAXX_SPARE1_N, LA1_LAXX_SPARE1_P, LA1_LAXX_SPARE2_N, LA1_LAXX_SPARE2_P, LA1_LAXX_SPARE3_N, LA1_LAXX_SPARE3_P, LA1_LAXX_SPARE5_N, LA1_LAXX_SPARE5_P, LA1_LAXX_SPARE6_N, LA1_LAXX_SPARE6_P
net class DE_SIG: CLKS1_CLK0_M2C_N, CLKS1_CLK0_M2C_P, CLKS1_CLK1_M2C_N, CLKS1_CLK1_M2C_P, CLKS1_CLK2_BIDIR_N, CLKS1_CLK2_BIDIR_P, CLKS1_CLK3_BIDIR_N, CLKS1_CLK3_BIDIR_P, HA1_HA00_CC_N, HA1_HA00_CC_P, HA1_HA01_CC_N, HA1_HA01_CC_P, HA1_HA02_N, HA1_HA02_P, HA1_HA03_N, HA1_HA03_P, HA1_HA04_N, HA1_HA04_P, HA1_HA05_N, HA1_HA05_P, HA1_HA06_N, HA1_HA06_P, HA1_HA07_N, HA1_HA07_P, HA1_HA08_N, HA1_HA08_P, HA1_HA09_N, HA1_HA09_P, HA1_HA10_N, HA1_HA10_P, HA1_HA11_N, HA1_HA11_P, HA1_HA12_N, HA1_HA12_P, HA1_HA13_N, HA1_HA13_P, HA1_HA14_N, HA1_HA14_P, HA1_HA15_N, HA1_HA15_P, HA1_HA16_N, HA1_HA16_P, HA1_HA17_CC_N, HA1_HA17_CC_P, HA1_HA18_N, HA1_HA18_P, HA1_HA19_N, HA1_HA19_P, HA1_HA20_N, HA1_HA20_P, HA1_HA21_N, HA1_HA21_P, HA1_HA22_N, HA1_HA22_P, HA1_HA23_N, HA1_HA23_P, HB1_HB00_CC_N, HB1_HB00_CC_P, HB1_HB01_N, HB1_HB01_P, HB1_HB02_N, HB1_HB02_P, HB1_HB03_N, HB1_HB03_P, HB1_HB04_N, HB1_HB04_P, HB1_HB05_N, HB1_HB05_P, HB1_HB06_CC_N, HB1_HB06_CC_P, HB1_HB07_N, HB1_HB07_P, HB1_HB08_N, HB1_HB08_P, HB1_HB09_N, HB1_HB09_P, HB1_HB10_N, HB1_HB10_P, HB1_HB11_N, HB1_HB11_P, HB1_HB12_N, HB1_HB12_P, HB1_HB13_N, HB1_HB13_P, HB1_HB14_N, HB1_HB14_P, HB1_HB15_N, HB1_HB15_P, HB1_HB16_N, HB1_HB16_P, HB1_HB17_CC_N, HB1_HB17_CC_P, HB1_HB18_N, HB1_HB18_P, HB1_HB19_N, HB1_HB19_P, HB1_HB20_N, HB1_HB20_P, HB1_HB21_N, HB1_HB21_P, LA1_LA00_CC_N, LA1_LA00_CC_P, LA1_LA01_CC_N, LA1_LA01_CC_P, LA1_LA02_N, LA1_LA02_P, LA1_LA03_N, LA1_LA03_P, LA1_LA04_N, LA1_LA04_P, LA1_LA05_N, LA1_LA05_P, LA1_LA06_N, LA1_LA06_P, LA1_LA07_N, LA1_LA07_P, LA1_LA08_N, LA1_LA08_P, LA1_LA09_N, LA1_LA09_P, LA1_LA10_N, LA1_LA10_P, LA1_LA11_N, LA1_LA11_P, LA1_LA12_N, LA1_LA12_P, LA1_LA13_N, LA1_LA13_P, LA1_LA14_N, LA1_LA14_P, LA1_LA15_N, LA1_LA15_P, LA1_LA16_N, LA1_LA16_P, LA1_LA17_CC_N, LA1_LA17_CC_P, LA1_LA18_CC_N, LA1_LA18_CC_P, LA1_LA19_N, LA1_LA19_P, LA1_LA20_N, LA1_LA20_P, LA1_LA21_N, LA1_LA21_P, LA1_LA22_N, LA1_LA22_P, LA1_LA23_N, LA1_LA23_P, LA1_LA24_N, LA1_LA24_P, LA1_LA25_N, LA1_LA25_P, LA1_LA26_N, LA1_LA26_P, LA1_LA27_N, LA1_LA27_P, LA1_LA28_N, LA1_LA28_P, LA1_LA29_N, LA1_LA29_P, LA1_LA30_N, LA1_LA30_P, LA1_LA31_N, LA1_LA31_P, LA1_LA32_N, LA1_LA32_P, LA1_LA33_N, LA1_LA33_P, LA1_LAXX_SPARE0_N, LA1_LAXX_SPARE0_P, LA1_LAXX_SPARE1_N, LA1_LAXX_SPARE1_P, LA1_LAXX_SPARE2_N, LA1_LAXX_SPARE2_P, LA1_LAXX_SPARE3_N, LA1_LAXX_SPARE3_P, LA1_LAXX_SPARE5_N, LA1_LAXX_SPARE5_P, LA1_LAXX_SPARE6_N, LA1_LAXX_SPARE6_P
net class FMC1_LA: LA1_LA00_CC_N, LA1_LA00_CC_P, LA1_LA01_CC_N, LA1_LA01_CC_P, LA1_LA02_N, LA1_LA02_P, LA1_LA03_N, LA1_LA03_P, LA1_LA04_N, LA1_LA04_P, LA1_LA05_N, LA1_LA05_P, LA1_LA06_N, LA1_LA06_P, LA1_LA07_N, LA1_LA07_P, LA1_LA08_N, LA1_LA08_P, LA1_LA09_N, LA1_LA09_P, LA1_LA10_N, LA1_LA10_P, LA1_LA11_N, LA1_LA11_P, LA1_LA12_N, LA1_LA12_P, LA1_LA13_N, LA1_LA13_P, LA1_LA14_N, LA1_LA14_P, LA1_LA15_N, LA1_LA15_P, LA1_LA16_N, LA1_LA16_P, LA1_LA17_CC_N, LA1_LA17_CC_P, LA1_LA18_CC_N, LA1_LA18_CC_P, LA1_LA19_N, LA1_LA19_P, LA1_LA20_N, LA1_LA20_P, LA1_LA21_N, LA1_LA21_P, LA1_LA22_N, LA1_LA22_P, LA1_LA23_N, LA1_LA23_P, LA1_LA24_N, LA1_LA24_P, LA1_LA25_N, LA1_LA25_P, LA1_LA26_N, LA1_LA26_P, LA1_LA27_N, LA1_LA27_P, LA1_LA28_N, LA1_LA28_P, LA1_LA29_N, LA1_LA29_P, LA1_LA30_N, LA1_LA30_P, LA1_LA31_N, LA1_LA31_P, LA1_LA32_N, LA1_LA32_P, LA1_LA33_N, LA1_LA33_P, LA1_LAXX_SPARE0_N, LA1_LAXX_SPARE0_P, LA1_LAXX_SPARE1_N, LA1_LAXX_SPARE1_P, LA1_LAXX_SPARE2_N, LA1_LAXX_SPARE2_P, LA1_LAXX_SPARE3_N, LA1_LAXX_SPARE3_P, LA1_LAXX_SPARE5_N, LA1_LAXX_SPARE5_P, LA1_LAXX_SPARE6_N, LA1_LAXX_SPARE6_P
net class FMC1_HA: HA1_HA00_CC_N, HA1_HA00_CC_P, HA1_HA01_CC_N, HA1_HA01_CC_P, HA1_HA02_N, HA1_HA02_P, HA1_HA03_N, HA1_HA03_P, HA1_HA04_N, HA1_HA04_P, HA1_HA05_N, HA1_HA05_P, HA1_HA06_N, HA1_HA06_P, HA1_HA07_N, HA1_HA07_P, HA1_HA08_N, HA1_HA08_P, HA1_HA09_N, HA1_HA09_P, HA1_HA10_N, HA1_HA10_P, HA1_HA11_N, HA1_HA11_P, HA1_HA12_N, HA1_HA12_P, HA1_HA13_N, HA1_HA13_P, HA1_HA14_N, HA1_HA14_P, HA1_HA15_N, HA1_HA15_P, HA1_HA16_N, HA1_HA16_P, HA1_HA17_CC_N, HA1_HA17_CC_P, HA1_HA18_N, HA1_HA18_P, HA1_HA19_N, HA1_HA19_P, HA1_HA20_N, HA1_HA20_P, HA1_HA21_N, HA1_HA21_P, HA1_HA22_N, HA1_HA22_P, HA1_HA23_N, HA1_HA23_P
net class FMC1_HB: HB1_HB00_CC_N, HB1_HB00_CC_P, HB1_HB01_N, HB1_HB01_P, HB1_HB02_N, HB1_HB02_P, HB1_HB03_N, HB1_HB03_P, HB1_HB04_N, HB1_HB04_P, HB1_HB05_N, HB1_HB05_P, HB1_HB06_CC_N, HB1_HB06_CC_P, HB1_HB07_N, HB1_HB07_P, HB1_HB08_N, HB1_HB08_P, HB1_HB09_N, HB1_HB09_P, HB1_HB10_N, HB1_HB10_P, HB1_HB11_N, HB1_HB11_P, HB1_HB12_N, HB1_HB12_P, HB1_HB13_N, HB1_HB13_P, HB1_HB14_N, HB1_HB14_P, HB1_HB15_N, HB1_HB15_P, HB1_HB16_N, HB1_HB16_P, HB1_HB17_CC_N, HB1_HB17_CC_P, HB1_HB18_N, HB1_HB18_P, HB1_HB19_N, HB1_HB19_P, HB1_HB20_N, HB1_HB20_P, HB1_HB21_N, HB1_HB21_P
net class FMC1_REST: CLKS1_CLK0_M2C_N, CLKS1_CLK0_M2C_P, CLKS1_CLK1_M2C_N, CLKS1_CLK1_M2C_P, CLKS1_CLK2_BIDIR_N, CLKS1_CLK2_BIDIR_P, CLKS1_CLK3_BIDIR_N, CLKS1_CLK3_BIDIR_P, FMC1_VREF_A_M2C, FMC1_VREF_B_M2C
net class BANK_16: HA1_HA00_CC_N, HA1_HA00_CC_P, HA1_HA01_CC_N, HA1_HA01_CC_P, HA1_HA02_N, HA1_HA02_P, HA1_HA03_N, HA1_HA03_P, HA1_HA04_N, HA1_HA04_P, HA1_HA05_N, HA1_HA05_P, HA1_HA06_N, HA1_HA06_P, HA1_HA07_N, HA1_HA07_P, HA1_HA08_N, HA1_HA08_P, HA1_HA09_N, HA1_HA09_P, HA1_HA10_N, HA1_HA10_P, HA1_HA11_N, HA1_HA11_P, HA1_HA12_N, HA1_HA12_P, HA1_HA13_N, HA1_HA13_P, HA1_HA14_N, HA1_HA14_P, HA1_HA15_N, HA1_HA15_P, HA1_HA16_N, HA1_HA16_P, HA1_HA17_CC_N, HA1_HA17_CC_P, HA1_HA18_N, HA1_HA18_P, HA1_HA19_N, HA1_HA19_P, HA1_HA20_N, HA1_HA20_P, HA1_HA21_N, HA1_HA21_P, HA1_HA22_N, HA1_HA22_P, HA1_HA23_N, HA1_HA23_P
net class BANK_34: FMC1_VREF_B_M2C, HB1_HB00_CC_N, HB1_HB00_CC_P, HB1_HB01_N, HB1_HB01_P, HB1_HB02_N, HB1_HB02_P, HB1_HB03_N, HB1_HB03_P, HB1_HB04_N, HB1_HB04_P, HB1_HB05_N, HB1_HB05_P, HB1_HB06_CC_N, HB1_HB06_CC_P, HB1_HB07_N, HB1_HB07_P, HB1_HB08_N, HB1_HB08_P, HB1_HB09_N, HB1_HB09_P, HB1_HB10_N, HB1_HB10_P, HB1_HB11_N, HB1_HB11_P, HB1_HB12_N, HB1_HB12_P, HB1_HB13_N, HB1_HB13_P, HB1_HB14_N, HB1_HB14_P, HB1_HB15_N, HB1_HB15_P, HB1_HB16_N, HB1_HB16_P, HB1_HB17_CC_N, HB1_HB17_CC_P, HB1_HB18_N, HB1_HB18_P, HB1_HB19_N, HB1_HB19_P, HB1_HB20_N, HB1_HB20_P, HB1_HB21_N, HB1_HB21_P
net class BANK_35: CLKS1_CLK1_M2C_N, CLKS1_CLK1_M2C_P, CLKS1_CLK3_BIDIR_N, CLKS1_CLK3_BIDIR_P, FMC1_VREF_A_M2C, FPGA_I2C_SCL, FPGA_I2C_SDA, LA1_LA17_CC_N, LA1_LA17_CC_P, LA1_LA18_CC_N, LA1_LA18_CC_P, LA1_LA19_N, LA1_LA19_P, LA1_LA20_N, LA1_LA20_P, LA1_LA21_N, LA1_LA21_P, LA1_LA22_N, LA1_LA22_P, LA1_LA23_N, LA1_LA23_P, LA1_LA24_N, LA1_LA24_P, LA1_LA25_N, LA1_LA25_P, LA1_LA26_N, LA1_LA26_P, LA1_LA27_N, LA1_LA27_P, LA1_LA28_N, LA1_LA28_P, LA1_LA29_N, LA1_LA29_P, LA1_LA30_N, LA1_LA30_P, LA1_LA31_N, LA1_LA31_P, LA1_LA32_N, LA1_LA32_P, LA1_LA33_N, LA1_LA33_P, LA1_LAXX_SPARE0_N, LA1_LAXX_SPARE0_P, LA1_LAXX_SPARE3_N, LA1_LAXX_SPARE3_P, LA1_LAXX_SPARE5_N, LA1_LAXX_SPARE5_P
net class BANK_36: CLKS1_CLK0_M2C_N, CLKS1_CLK0_M2C_P, CLKS1_CLK2_BIDIR_N, CLKS1_CLK2_BIDIR_P, FLASH_CLK, FLASH_CSn, FMC1_VREF_A_M2C, LA1_LA00_CC_N, LA1_LA00_CC_P, LA1_LA01_CC_N, LA1_LA01_CC_P, LA1_LA02_N, LA1_LA02_P, LA1_LA03_N, LA1_LA03_P, LA1_LA04_N, LA1_LA04_P, LA1_LA05_N, LA1_LA05_P, LA1_LA06_N, LA1_LA06_P, LA1_LA07_N, LA1_LA07_P, LA1_LA08_N, LA1_LA08_P, LA1_LA09_N, LA1_LA09_P, LA1_LA10_N, LA1_LA10_P, LA1_LA11_N, LA1_LA11_P, LA1_LA12_N, LA1_LA12_P, LA1_LA13_N, LA1_LA13_P, LA1_LA14_N, LA1_LA14_P, LA1_LA15_N, LA1_LA15_P, LA1_LA16_N, LA1_LA16_P, LA1_LAXX_SPARE1_N, LA1_LAXX_SPARE1_P, LA1_LAXX_SPARE6_N, LA1_LAXX_SPARE6_P, LED_B, LED_G, LED_R
net class FMC1_LA_CC: LA1_LA00_CC_N, LA1_LA00_CC_P, LA1_LA01_CC_N, LA1_LA01_CC_P, LA1_LA17_CC_N, LA1_LA17_CC_P, LA1_LA18_CC_N, LA1_LA18_CC_P
net class FMC1_HA_CC: HA1_HA00_CC_N, HA1_HA00_CC_P, HA1_HA01_CC_N, HA1_HA01_CC_P, HA1_HA17_CC_N, HA1_HA17_CC_P
net class FMC1_HB_CC: HB1_HB00_CC_N, HB1_HB00_CC_P, HB1_HB06_CC_N, HB1_HB06_CC_P, HB1_HB17_CC_N, HB1_HB17_CC_P
net class FMC1_CLKS: CLKS1_CLK0_M2C_N, CLKS1_CLK0_M2C_P, CLKS1_CLK1_M2C_N, CLKS1_CLK1_M2C_P, CLKS1_CLK2_BIDIR_N, CLKS1_CLK2_BIDIR_P, CLKS1_CLK3_BIDIR_N, CLKS1_CLK3_BIDIR_P

### Notes on the sheet
- Copyright LNLS 2012.
  This documentation describes Open Hardware and is licensed under the CERN OHL v.1.1. You may redistribute and modify this documentation under the terms of the CERN OHL v.1.1. (http://ohwr.org/CERNOHL). This documentation is distributed WITHOUT ANY EXPRESS OR IMPLIED WARRANTY, INCLUDING OF MERCHANTABILITY, SATISFACTORY QUALITY AND FITNESS FOR A PARTICULAR PURPOSE. Please see the CERN OHL v.1.1 for applicable conditions.
- Bank Migrated
- (in symbol LED_OPTEK_OVSRRGBCC3_a) R; G; B
- (in symbol XC7A350T-2FFG1156C, part E) BANK 16
- (in symbol XC7A350T-2FFG1156C, part I) BANK 34
- (in symbol XC7A350T-2FFG1156C, part J) BANK 35
- (in symbol XC7A350T-2FFG1156C, part K) BANK 36

### Library data of the parts
C99 C100 C102 C111 C112 C114 C118 C120 C121 = CAP_SMD_0201: Capacitor SMD
IC2 = XC7A350T-2FFG1156C: Artix-6 FPGA, 16 GTPs, 600 User I/Os, 1156-Pin BGA, Speed Grade 2, Commercial Grade, Pb-Free; Part Description: Artix-7 FPGA, 16 GTPs, 600 User I/Os, 1156-Pin BGA, Speed Grade 2, Commercial Grade, Pb-Free; Manufacturer: XILINX; Table: Logic; Part Number: XC7A350T-2FFG1156C; Component Kind: Standard; Component Type: Standard; Device: XC7A350T-2FFG1156C; PackageDescription: BGA, 1.00mm Pitch, Square; 1156 Pin, 34 Columns X 34 Rows, 35.00mm X 35.00mm X 3.350mm H; Manufacturer Part Number: XC7A350T-2FFG1156C; Pin Count: 1156; Case: BGA1156; Mounted: Yes; Socket: No; SMD: Yes; ComponentHeight: 3.35mm; HelpURL: \\cern.ch\dfs\Applications\Altium\Datasheets\XC7A350T-2FFG1156C.pdf; ComponentLink1URL: \\cern.ch\dfs\Applications\Altium\Datasheets\XC7A350T-2FFG1156C.pdf; ComponentLink1Description: Package/Pinout; Author: CERN DEM JLC; CreateDate: 2012-09-19; LatestRevisionDate: 2012-09-19
IC56 = IFC_PCA9306: I2C BUS VOLTAGE-LEVEL TRANSLATOR
LD1 = LED_OPTEK_OVSRRGBCC3_a: Right Angle Tricolor (RGB) Surface Mount LED, Body 3.2x1mm; Part Description: Side Mount, Full-Color (RGB), 1204 Surface Mount LED (150° Viewing Angle); Manufacturer: OPTEK / TT ELECTRONICS; Table: LEDs & Displays; Part Number: LED_OPTEK_OVSRRGBCC3_a; Component Kind: Standard; Component Type: Standard; Color: Red/Green/Blue; PackageDescription: Side Mount, Full-Color (RGB), 1204 Surface Mount LED (150° Viewing Angle); Manufacturer Part Number: OVSRRGBCC3; Pin Count: 4; Mounted: Yes; Socket: No; SMD: Yes; ComponentHeight: 1mm; HelpURL: \\cern.ch\dfs\Applications\Altium\Datasheets\LED_OPTEK_OVSRRGBCC3.pdf; Author: CERN DEM JLC; CreateDate: 2011-08-09; LatestRevisionDate: 2011-08-09
Q7 Q10 Q11 = Q_BSS138
R83 R178 R179 R277-R282 = RES_0402: SMD Resistor; Supplier 1: Newark; Supplier Part Number 1: 59M6691
TP3-TP7 TP11-TP13 = TP: Testpoint